# EasyEDA Pro project ProDoc_USB2.0集线器_2024-09-16.epro

# Schematic USB2.0集线器
Board Name: Board1; Create Date: 2024-08-31; Company: HUST; Drawed: Wxz
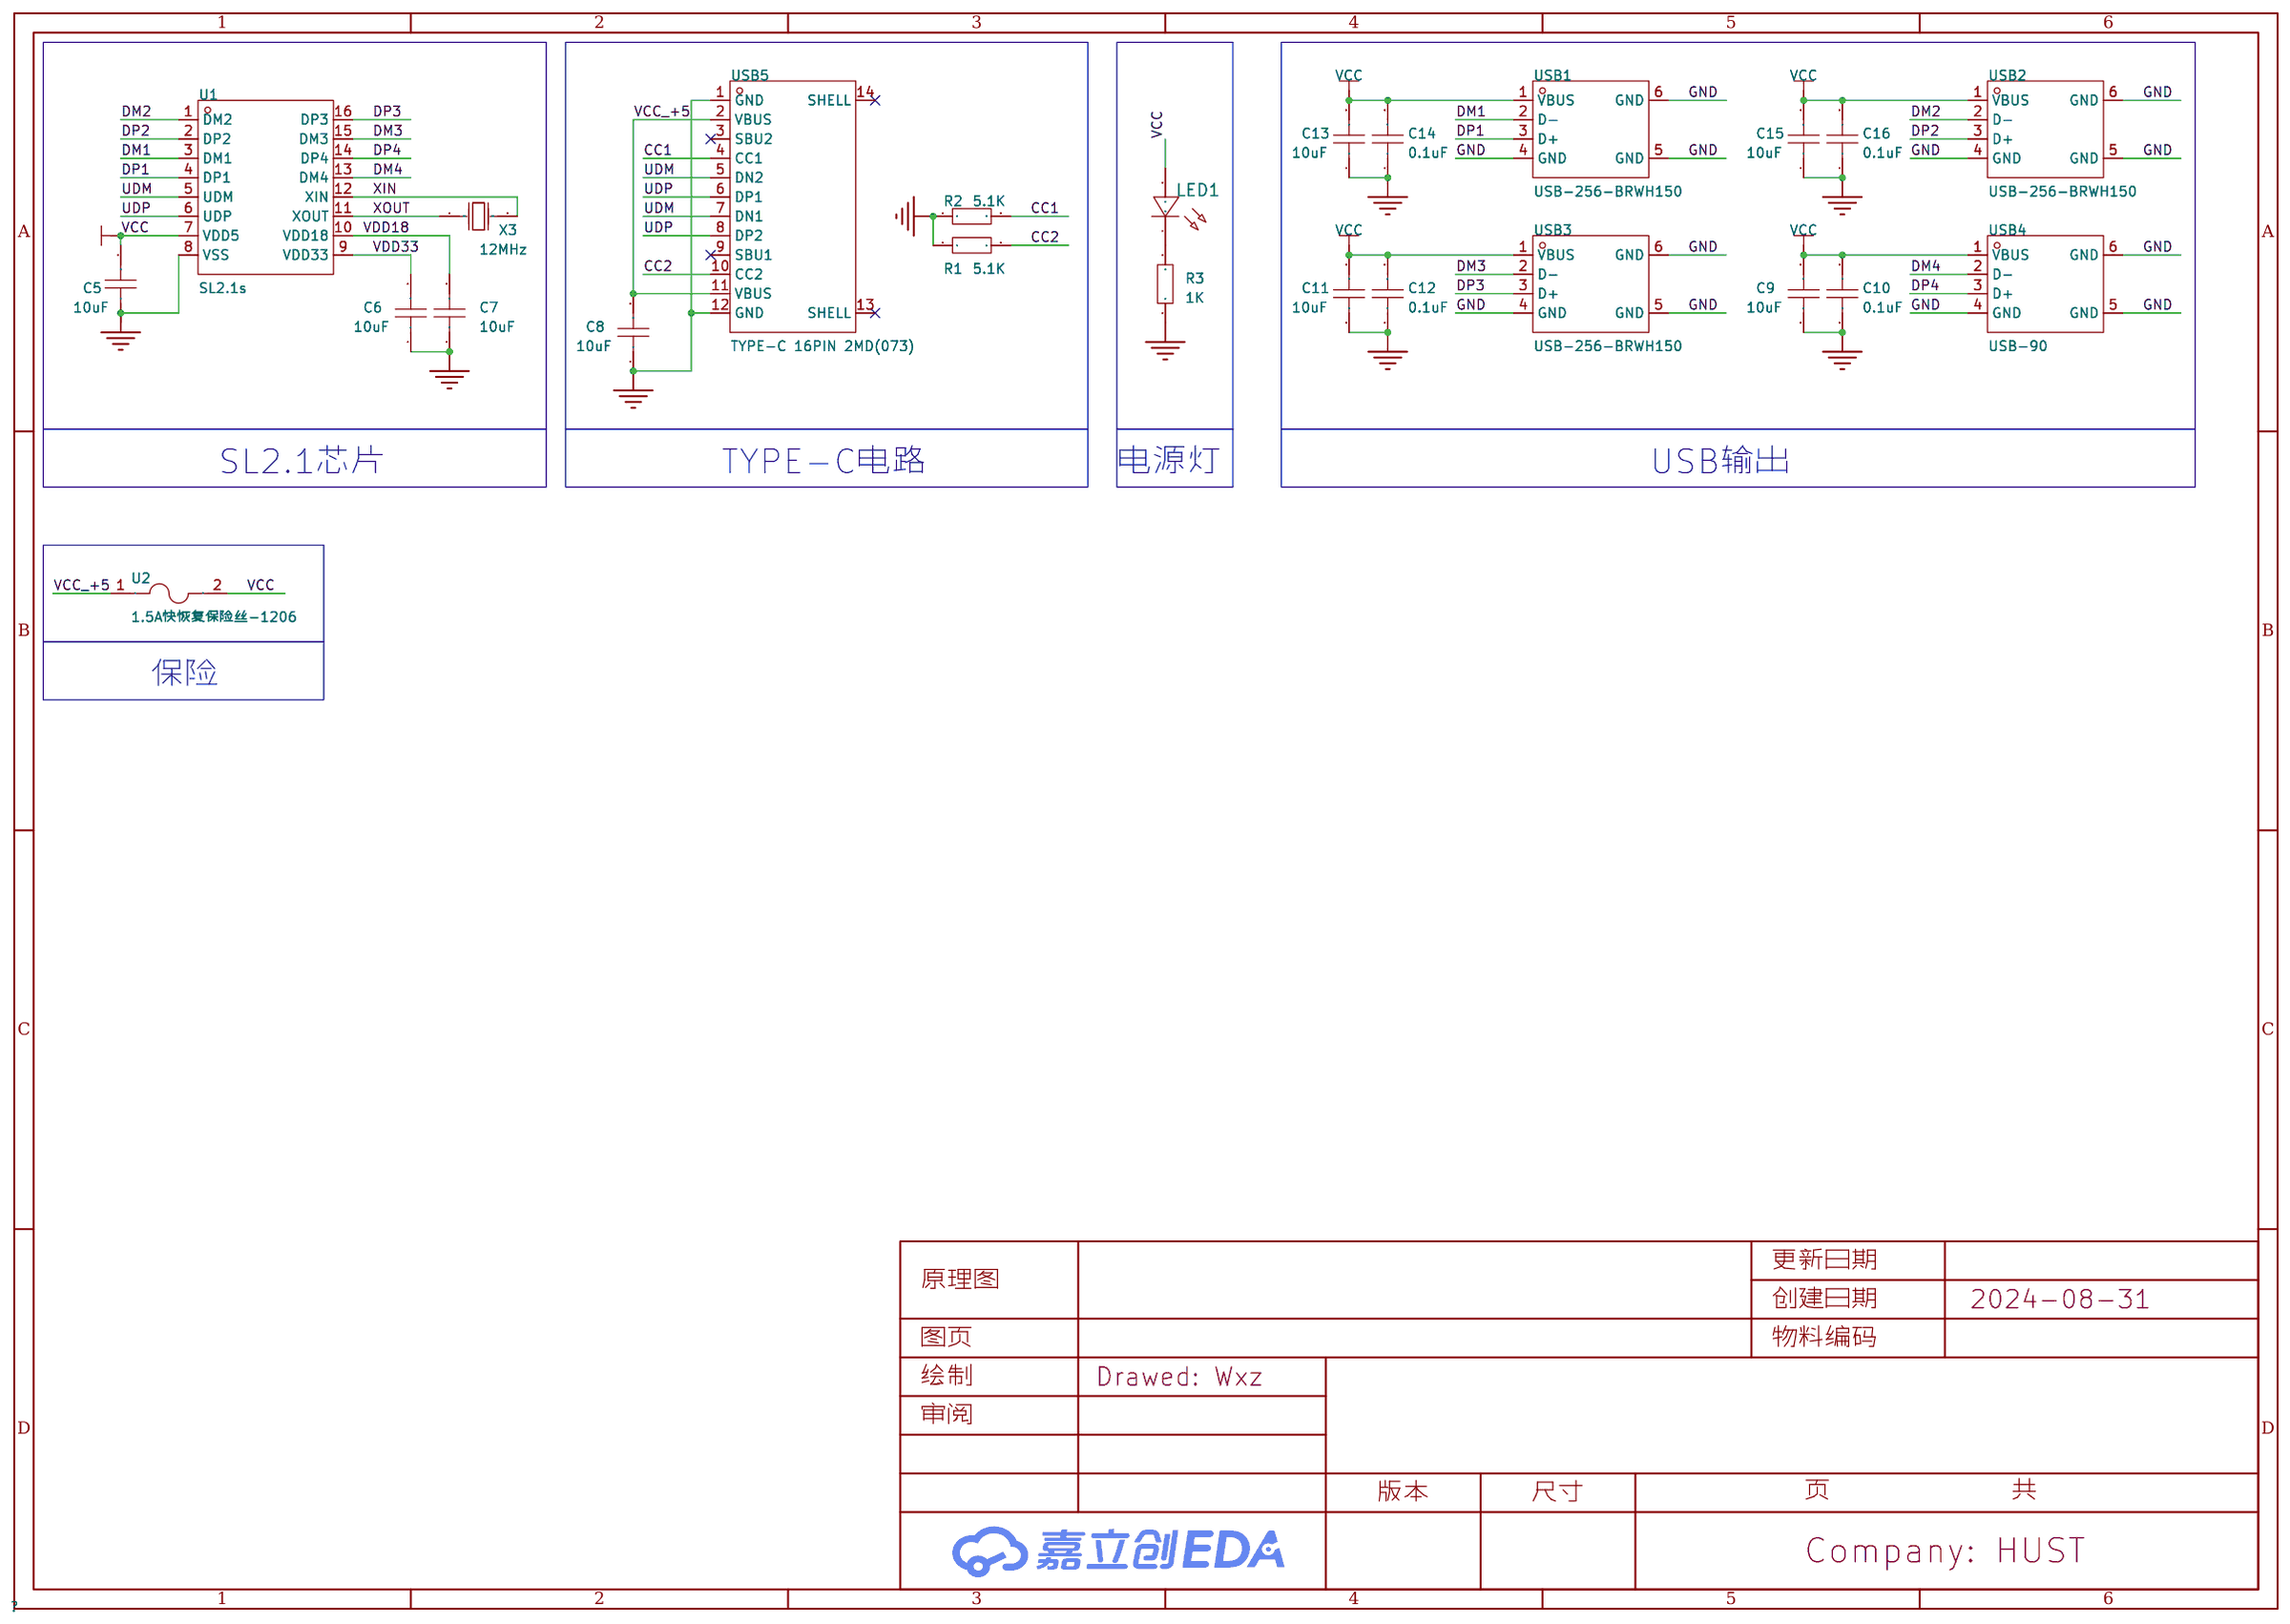
[diagram p0: schematic sheet]

## Parts
C5  10uF  [C0603]
C6  10uF  [C0603]
C7  10uF  [C0603]
C8  10uF  [C0603]
C9  10uF  [C0603]
C10  0.1uF  [C0603]
C11  10uF  [C0603]
C12  0.1uF  [C0603]
C13  10uF  [C0603]
C14  0.1uF  [C0603]
C15  10uF  [C0603]
C16  0.1uF  [C0603]
LED1  -  [LED_0603]
R1  5.1K  [R0603]
R2  5.1K  [R0603]
R3  1K  [R0603]
U1  SL2.1s  [SSOP-16_L4.6-W2.6-P0.53-LS4.0-BL]
U2  1.5A快恢复保险丝-1206  [F1206]
USB1  USB-256-BRWH150  [USB-A_TH_USB-256-BRWH150]
USB2  USB-256-BRWH150  [USB-A_TH_USB-256-BRWH150]
USB3  USB-256-BRWH150  [USB-A_TH_USB-256-BRWH150]
USB4  USB-90  [USB-A-TH_USB-231-ARY]
USB5  TYPE-C 16PIN 2MD(073)  [USB-C-SMD_TYPE-C-6PIN-2MD-073]
X3  12MHz  [HC-49S_L11.4-W4.8]

## Library data of the parts
C5-C16 = CAP_0603: Supplier Footprint: 0603
LED1 = LED_0603-R: Supplier Footprint: 0603
R1-R3 = Res_0603: Supplier Footprint: 0603
U1 = SL2.1s: 应用功能:集线器;接口协议:-;; Supplier Part: C2684433; Manufacturer: CoreChips(和芯润德); Supplier Footprint: SSOP-16-2.6mm; JLCPCB Part Class: 扩展库; Datasheet: https://atta.szlcsc.com/upload/public/pdf/source/20210326/C2684433_0308B0C984AD3FC6CBDA43F1CDB06B3F.pdf; Supplier: LCSC; Applications Function: 集线器
U2 = 1.5A快恢复保险丝-1206: Supplier Part: C9900012139; JLCPCB Part Class: 扩展库; Supplier: LCSC
USB1-USB3 = USB-256-BRWH150: 连接器类型:Type-A;标准:USB 2.0;公母:母;端口数量:1;触点数量:4P;安装方式:直插;额定电流 - 电源:1.5A;工作温度范围:-20℃~+70℃;焊接温度(最大值):260℃;; LCSC Part Name: Type-A 母 直插; Supplier Part: C720544; Manufacturer: XUNPU(讯普); Supplier Footprint: 插件; JLCPCB Part Class: 扩展库; Datasheet: https://atta.szlcsc.com/upload/public/pdf/source/20200812/C720544_3A01B35EF472B7FB04986893C594DBBE.pdf; Supplier: LCSC; Connector Type: Type-A; Standard: USB 2.0; Gender: 母; Number of Ports: 1; Number of Contacts: 4P; Mounting Style: 直插; Current Rating - Power (Max): 1.5A; Operating Temperature Range: -20℃~+70℃; Soldering Temperature(Max): 260℃
USB4 = USB-231-BRW: 连接器类型:Type-A;标准:USB 2.0;公母:母;端口数量:1;触点数量:4P;安装方式:弯插;额定电流 - 电源:1.5A;触头材质:-;触头镀层:-;工作温度范围:-20℃~+70℃;焊接温度(最大值):260℃;; LCSC Part Name: Type-A 母 弯插; Supplier Part: C720526; Manufacturer: XUNPU(讯普); Supplier Footprint: 插件; JLCPCB Part Class: 扩展库; Datasheet: https://atta.szlcsc.com/upload/public/pdf/source/20200810/C720526_4837E23757308E8DFF7007387B1B5646.pdf; Supplier: LCSC; Connector Type: Type-A; Standard: USB 2.0; Gender: 母; Number of Ports: 1; Number of Contacts: 4P; Mounting Style: 弯插; Current Rating - Power (Max): 1.5A; Operating Temperature Range: -20℃~+70℃; Soldering Temperature(Max): 260℃
USB5 = TYPE-C 16PIN 2MD(073): 连接器类型:Type-C;标准:-;公母:母;端口数量:1;触点数量:16P;安装方式:卧贴;额定电流 - 电源:5A;工作温度范围:-25℃~+85℃;; LCSC Part Name: Type-C 母 卧贴; Supplier Part: C2765186; Manufacturer: SHOU HAN(首韩); Supplier Footprint: SMD; JLCPCB Part Class: 扩展库; Datasheet: https://atta.szlcsc.com/upload/public/pdf/source/20211123/39B17C16241EAC15C5E277BDA434118E.pdf; Supplier: LCSC; Connector Type: Type-C; Gender: 母; Number of Ports: 1; Number of Contacts: 16P; Mounting Style: 卧贴; Current Rating - Power (Max): 5A; Operating Temperature Range: -25℃~+85℃
X3 = X49SM12MSD2SI: 晶振类型:贴片晶振;频率:12MHz;常温频差:±20ppm;外接负载电容:20pF;频率稳定度(全温):±30ppm;; LCSC Part Name: 12MHz ±20ppm 20pF; Supplier Part: C108151; Manufacturer: YXC(扬兴晶振); Supplier Footprint: HC-49S-SMD; JLCPCB Part Class: 扩展库; Datasheet: https://atta.szlcsc.com/upload/public/pdf/source/20240329/3EBF42EBCAB50CA65B6FA9D7CFA1955A.pdf; Supplier: LCSC; Crystal Type: 贴片晶振; Normal temperature Frequency Tolerance: ±20ppm; External load capacitor: 20pF; Frequency Stability(Full temperature range): ±30ppm; Equivalent Series Resistance (ESR): 40Ω; Operating Temperature: -40℃~+85℃

## Nets
GND: C5.1 C6.1 C7.1 C8.1 C9.1 C10.1 C11.1 C12.1 C13.1 C14.1 C15.1 C16.1 R1.1 R2.1 R3.1 U1.8(VSS) USB1.4(GND) USB1.5(GND) USB1.6(GND) USB2.4(GND) USB2.5(GND) USB2.6(GND) USB3.4(GND) USB3.5(GND) USB3.6(GND) USB4.4(GND) USB4.5(GND) USB4.6(GND) USB5.1(GND) USB5.12(GND)
VCC: C5.2 C9.2 C10.2 C11.2 C12.2 C13.2 C14.2 C15.2 C16.2 LED1.2(A) U1.7(VDD5) U2.2 USB1.1(VBUS) USB2.1(VBUS) USB3.1(VBUS) USB4.1(VBUS)
VCC_+5: C8.2 U2.1 USB5.2(VBUS) USB5.11(VBUS)
VDD18: C7.2 U1.10(VDD18)
VDD33: C6.2 U1.9(VDD33)
CC1: R2.2 USB5.4(CC1)
CC2: R1.2 USB5.10(CC2)
DM1: U1.3(DM1) USB1.2(D-)
DM2: U1.1(DM2) USB2.2(D-)
DM3: U1.15(DM3) USB3.2(D-)
DM4: U1.13(DM4) USB4.2(D-)
DP1: U1.4(DP1) USB1.3(D+)
DP2: U1.2(DP2) USB2.3(D+)
DP3: U1.16(DP3) USB3.3(D+)
DP4: U1.14(DP4) USB4.3(D+)
UDM: U1.5(UDM) USB5.5(DN2) USB5.7(DN1)
UDP: U1.6(UDP) USB5.6(DP1) USB5.8(DP2)
XIN: U1.12(XIN) X3.2(OSC2)
XOUT: U1.11(XOUT) X3.1(OSC1)
Net-(LED1-1): LED1.1(C) R3.2

Not connected (* = marked no-connect by the designer): USB5 3(SBU2)* 9(SBU1)* 13(SHELL)* 14(SHELL)*

## Notes on the sheet
- SL2.1芯片
- TYPE-C电路
- 电源灯
- USB输出
- 保险
